# Altium schematic sheet measurement_ch1.SchDoc: Measurements CH1
size A4; Date: 2015-02-22; Author: Piotr Kuligowski; Revision: 1-0; SheetTotal: 14; Model: EM1
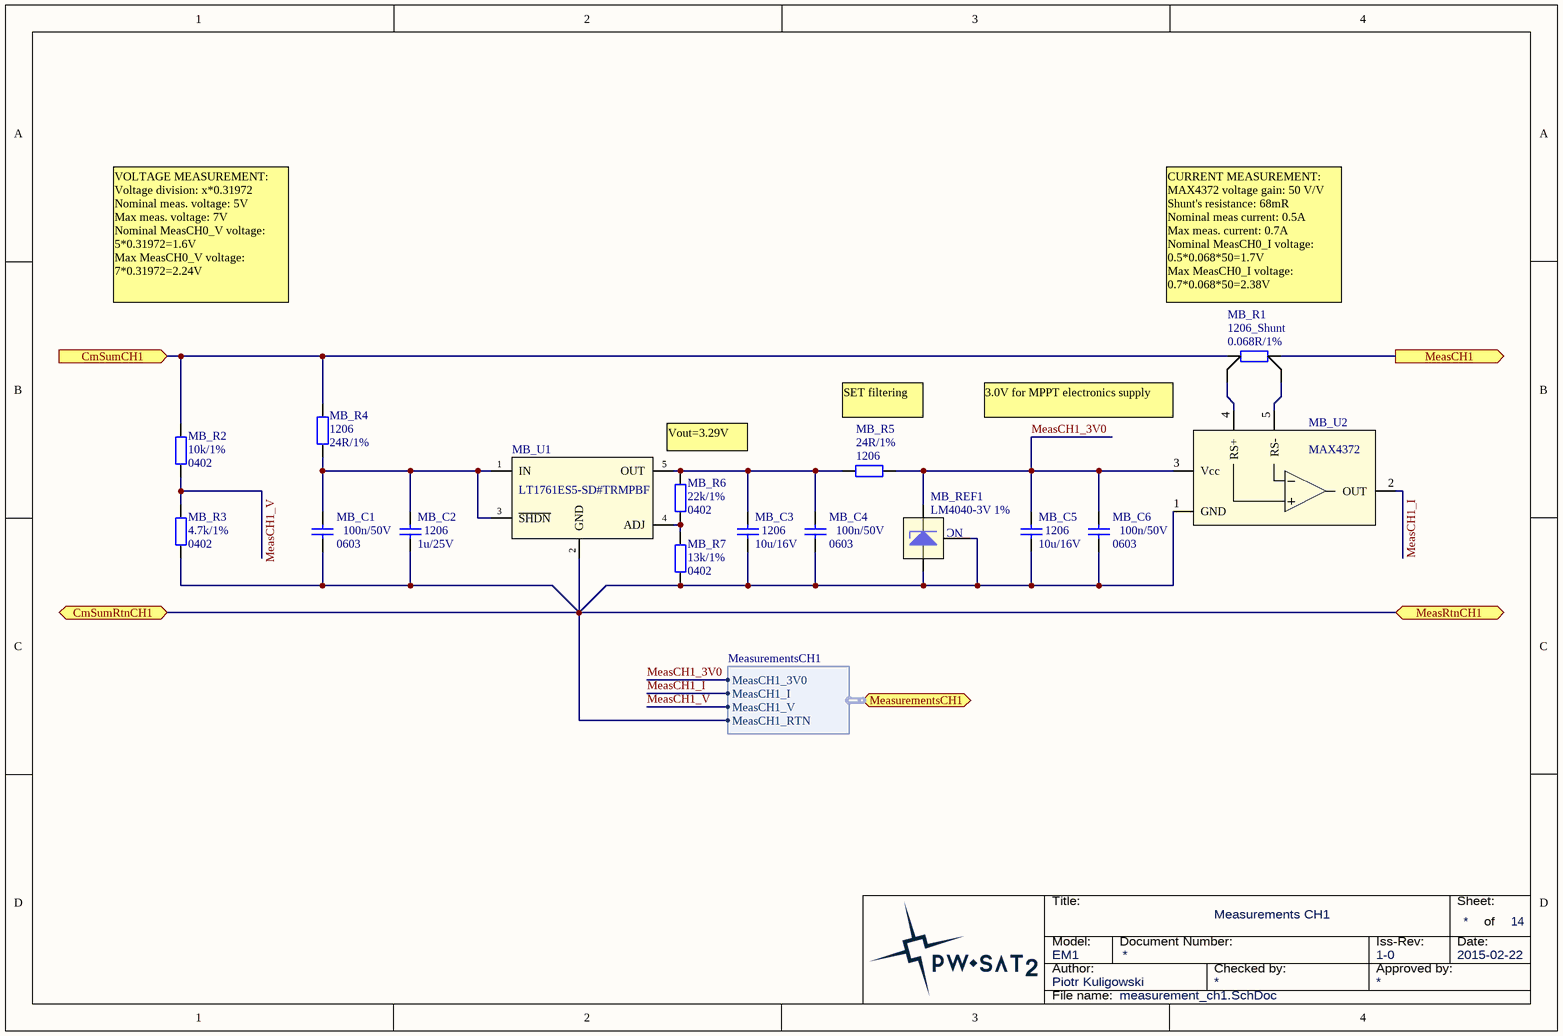
[diagram p0: measurement_ch1.SchDoc]

## Parts
MB_C1  Package: 0603  [SMD_Capacitor_0603]  (hidden comment: 100n/50V)
MB_C2  Package: 1206  [SMD_Capacitor_1206]  (hidden comment: 1u/25V)
MB_C3  Packge: 1206  [SMD_Capacitor_1206]  (hidden comment: 10u/16V)
MB_C4  Package: 0603  [SMD_Capacitor_0603]  (hidden comment: 100n/50V)
MB_C5  Packge: 1206  [SMD_Capacitor_1206]  (hidden comment: 10u/16V)
MB_C6  Package: 0603  [SMD_Capacitor_0603]  (hidden comment: 100n/50V)
MB_R1  Package: 1206_Shunt  [SMD_Resistor-Shunt_1206]  (hidden comment: 0.068R/1%)
MB_R2  Package: 0402  [SMD_Resistor_0402]  (hidden comment: 10k/1%)
MB_R3  Package: 0402  [SMD_Resistor_0402]  (hidden comment: 4.7k/1%)
MB_R4  Package: 1206  [SMD_Resistor_1206]  (hidden comment: 24R/1%)
MB_R5  Package: 1206  [SMD_Resistor_1206]  (hidden comment: 24R/1%)
MB_R6  Package: 0402  [SMD_Resistor_0402]  (hidden comment: 22k/1%)
MB_R7  Package: 0402  [SMD_Resistor_0402]  (hidden comment: 13k/1%)
MB_REF1  LM4040-3V 1%  [SOT23-3]
MB_U1  LT1761ES5-SD#TRMPBF  [SOT23-5]
MB_U2  MAX4372  [SOT23-5]

## Ports
CmSumCH1 (in), CmSumRtnCH1, MeasCH1 (out), MeasRtnCH1, MeasurementsCH1 (harness MeasurementsCH1)

## Harnesses
MeasurementsCH1: MeasCH1_RTN, MeasCH1_V, MeasCH1_I, MeasCH1_3V0

## Nets
CmSumCH1: MB_R1.1 MB_R2.1 MB_R4.1 ; port CmSumCH1
CmSumRtnCH1: MB_C1.2 MB_C2.2 MB_C3.2 MB_C4.2 MB_C5.2 MB_C6.2 MB_R3.2 MB_R7.2 MB_REF1.2(A) MB_REF1.3(NC) MB_U1.2(GND) MB_U2.1(GND) ; port MeasRtnCH1, port CmSumRtnCH1, port MeasurementsCH1.MeasCH1_RTN
MeasCH1: MB_R1.4 ; port MeasCH1
MeasCH1_3V0: MB_C5.1 MB_C6.1 MB_R5.2 MB_REF1.1(K) MB_U2.3(Vcc) ; port MeasurementsCH1.MeasCH1_3V0
MeasCH1_I: MB_U2.2(OUT) ; port MeasurementsCH1.MeasCH1_I
MeasCH1_V: MB_R2.2 MB_R3.1 ; port MeasurementsCH1.MeasCH1_V
NetMB_C1_1: MB_C1.1 MB_C2.1 MB_R4.2 MB_U1.1(IN) MB_U1.3(~{SHDN})
NetMB_C3_1: MB_C3.1 MB_C4.1 MB_R5.1 MB_R6.1 MB_U1.5(OUT)
NetMB_R1_2: MB_R1.2 MB_U2.4(RS+)
NetMB_R1_3: MB_R1.3 MB_U2.5(RS-)
NetMB_R6_2: MB_R6.2 MB_R7.1 MB_U1.4(ADJ)

## Notes on the sheet
- VOLTAGE MEASUREMENT:
  Voltage division: x*0.31972
  Nominal meas. voltage: 5V
  Max meas. voltage: 7V
  Nominal MeasCH0_V voltage: 5*0.31972=1.6V
  Max MeasCH0_V voltage: 7*0.31972=2.24V
- CURRENT MEASUREMENT:
  MAX4372 voltage gain: 50 V/V
  Shunt's resistance: 68mR
  Nominal meas current: 0.5A
  Max meas. current: 0.7A
  Nominal MeasCH0_I voltage: 0.5*0.068*50=1.7V
  Max MeasCH0_I voltage: 0.7*0.068*50=2.38V
- Vout=3.29V
- SET filtering
- (near MB_U2) 3.0V for MPPT electronics supply
- Title:
- Sheet:
- of
- Author:
- Model:
- Document Number:
- Checked by:
- Iss-Rev:
- Approved by:
- Date:
- File name:

## Library data of the parts
MB_C1 MB_C4 MB_C6 = Cer_GCJ188R71H104KA12D: Ceramic Cap Murata Automotive 100n/50V X7R 0603; Manufacturer: Murata; ManufacturerPartNumber: GCJ188R71H104KA12D; Value: 100n/50V
MB_C2 = Cer_C1206T105K3RALTU: Ceramic Cap Kemet COTS 1u/25V X7R 1206; ManufacturerPartNumber: C1206T105K3RALTU; Manufacturer: Kemet; Value: 1u/25V
MB_C3 MB_C5 = Cer_C1206T106K4RACTU: Ceramic Cap Kemet COTS 10u/16V X7R 1206; ManufacturerPartNumber: C1206T106K4RACTU; Manufacturer: Kemet; Value: 10u/16V
MB_R1 = ERJ-8BWFR068V: Panasonic Resistor 68mR 1% 1206 1W; Manufacturer: Panasonic; ManufacturerPartNumber: ERJ-8BWFR068V; Value: 0.068R/1%
MB_R2 = CRCW040210K0FKxxxx: 10k/1% Vishay CRCW 0402 Resistor. 63mW, 100ppm, 50V.; Manufacturer: Vishay; ManufacturerPartNumber: CRCW040210K0FKxxxx; Value: 10k/1%
MB_R3 = CRCW04024K70FKxxxx: 4.7k/1% Vishay CRCW 0402 Resistor. 63mW, 100ppm, 50V.; ManufacturerPartNumber: CRCW04024K70FKxxxx; Manufacturer: Vishay; Value: 4.7k/1%
MB_R4 MB_R5 = CRCW120624R0FKxxxx: 24R/1% Vishay CRCW 1206 Resistor. 250mW, 100ppm, 200V.; ManufacturerPartNumber: CRCW120624R0FKxxxx; Manufacturer: Vishay; Value: 24R/1%
MB_R6 = CRCW040222K0FKxxxx: 22k/1% Vishay CRCW 0402 Resistor. 63mW, 100ppm, 50V.; Manufacturer: Vishay; ManufacturerPartNumber: CRCW040222K0FKxxxx; Value: 22k/1%
MB_R7 = CRCW040213K0FKxxxx: 13k/1% Vishay CRCW 0402 Resistor. 63mW, 100ppm, 50V.; ManufacturerPartNumber: CRCW040213K0FKxxxx; Manufacturer: Vishay; Value: 13k/1%
MB_REF1 = LM4040DIM3-3.0: Shunt V-REF, 3V, 1%, SOT23-3; Manufacturer: Texas Instruments; ManufacturerPartNumber: LM4040DIM3-3.0; Value: LM4040-3V 1%
MB_U1 = LT1761ES5-SD#TRMPBF: 100mA, Regulated, Low Noise, LDO Micropower Regulator in TSOT-23; Manufacturer: Linear Technology; Value: LT1761ES5-SD#TRMPBF
MB_U2 = MAX4372: High-Side Current-Sense Amplifier with Voltage Output; Manufacturer: Maxim Integrated Products; Value: MAX4372